# EAGLE design cyberdriver_rev2 (EAGLE 6.5.0)
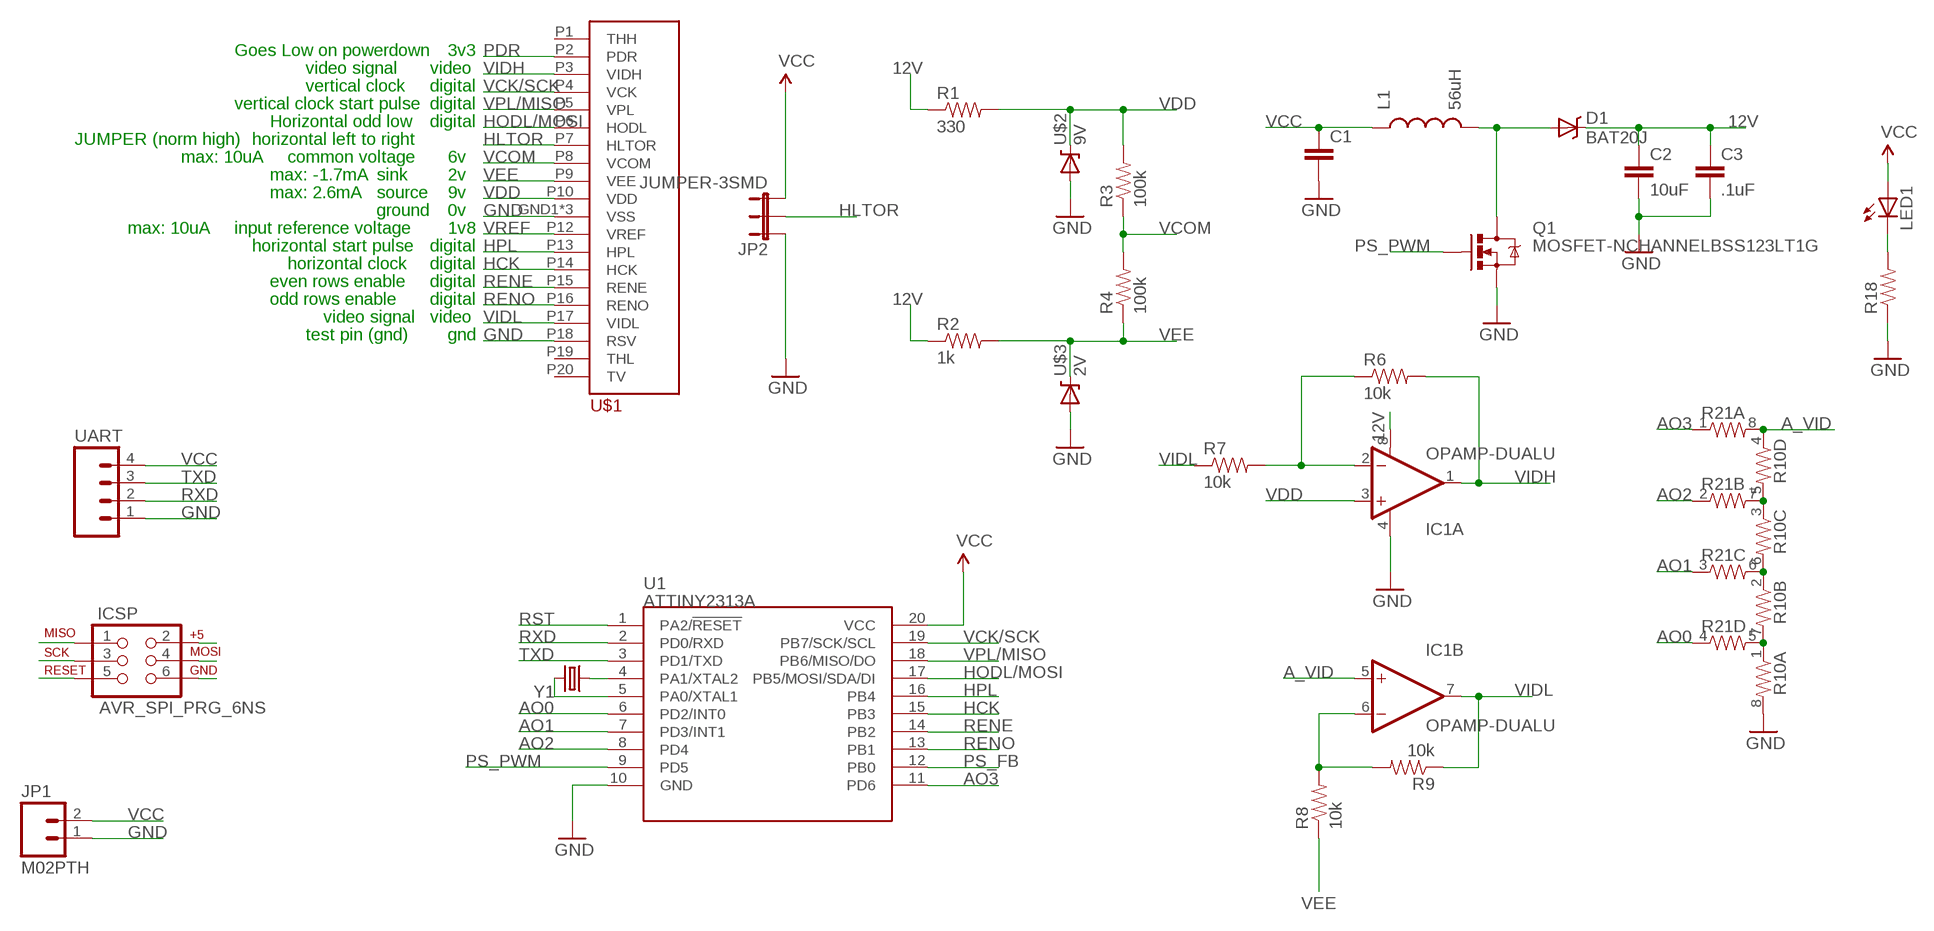
[diagram p0: schematic, sheet 1]

## Parts
C1  CAP1206  [1206]
C2  10uF  CAP1210  [1210]
C3  .1uF  CAP0603-CAP  [0603-CAP]
D1  BAT20J  DIODE-SCHOTTKY-BAT20J  [SOD-323]
IC1  OPAMP-DUALU  [SO08]
ICSP  AVR_SPI_PRG_6NS  [2X3-NS]
JP1  M02PTH  [1X02]
JP2  JUMPER-3SMD  [SJ_3]
L1  56uH  INDUCTORSDR0403-560KL  [SDR0403]
LED1  LED1206  [LED-1206]
Q1  MOSFET-NCHANNELBSS123LT1G  [SOT23]
R1  330  RESISTOR0603-RES  [0603-RES]
R2  1k  RESISTOR0603-RES  [0603-RES]
R3  100k  RESISTOR0603-RES  [0603-RES]
R4  100k  RESISTOR0603-RES  [0603-RES]
R6  10k  RESISTOR0603-RES  [0603-RES]
R7  10k  RESISTOR0603-RES  [0603-RES]
R8  10k  RESISTOR0603-RES  [0603-RES]
R9  10k  RESISTOR0603-RES  [0603-RES]
R10  RESISTOR-ARRAY0603-ARV  [0603-ARV]
R18  RESISTOR0805-RES  [0805]
R21  RESISTOR-ARRAY0603-ARV  [0603-ARV]
U1  ATTINY2313A  [SOP20W]
U$1  CYBERDISPLAY-CONN  [MOLEX-54550-2071]
U$2  9V  DIODE-ZENER-BZT52  [SOD-323]
U$3  2V  DIODE-ZENER-BZT52  [SOD-323]
UART  M041.27MM  [1X04-1.27MM]
Y1  CRYSTAL5X3  [CRYSTAL-SMD-5X3]

## Nets
12V: C2.1 C3.1 D1.C IC1.8(A:V+) R1.1 R2.1
A_VID: IC1.5(B:+IN) R10.4 R21.8
AO0: R21.4 U1.6(PD2/INT0)
AO1: R21.3 U1.7(PD3/INT1)
AO2: R21.2 U1.8(PD4)
AO3: R21.1 U1.11(PD6)
GND: C1.2 C2.2 C3.2 IC1.4(A:V-) ICSP.6 JP1.1 JP2.1 Q1.2(S) R10.8 R18.1 U1.10(GND) U$1.GND1(VSS) U$1.GND20(VSS) U$1.P11(VSS) U$1.P18(RSV) U$2.A U$3.A UART.1
HCK: U1.15(PB3) U$1.P14(HCK)
HLTOR: JP2.2 U$1.P7(HLTOR)
HODL/MOSI: ICSP.4 U1.17(PB5/MOSI/SDA/DI) U$1.P6(HODL)
HPL: U1.16(PB4) U$1.P13(HPL)
N$1: U1.5(PA0/XTAL1) Y1.3
N$2: U1.4(PA1/XTAL2) Y1.1
N$3: LED1.C R18.2
N$4: D1.A L1.P$2 Q1.3(D)
N$5: IC1.2(A:-IN) R6.1 R7.2
N$6: R10.3 R10.5 R21.7
N$7: IC1.6(B:-IN) R8.2 R9.2
N$8: R10.2 R10.6 R21.6
N$9: R10.1 R10.7 R21.5
PDR: U$1.P2(PDR)
PS_FB: U1.12(PB0)
PS_PWM: Q1.1(G) U1.9(PD5)
RENE: U1.14(PB2) U$1.P15(RENE)
RENO: U1.13(PB1) U$1.P16(RENO)
RST: ICSP.5 U1.1(PA2/!RESET)
RXD: U1.2(PD0/RXD) UART.2
TXD: U1.3(PD1/TXD) UART.3
VCC: C1.1 ICSP.2 JP1.2 JP2.3 L1.P$1 LED1.A U1.20(VCC) UART.4
VCK/SCK: ICSP.3 U1.19(PB7/SCK/SCL) U$1.P4(VCK)
VCOM: R3.1 R4.2 U$1.P8(VCOM)
VDD: IC1.3(A:+IN) R1.2 R3.2 U$1.P10(VDD) U$2.C
VEE: R2.2 R4.1 R8.1 U$1.P9(VEE) U$3.C
VIDH: IC1.1(A:OUT) R6.2 U$1.P3(VIDH)
VIDL: IC1.7(B:OUT) R7.1 R9.1 U$1.P17(VIDL)
VPL/MISO: ICSP.1 U1.18(PB6/MISO/DO) U$1.P5(VPL)
VREF: U$1.P12(VREF)
Unconnected: U$1.P1(THH) U$1.P19(THL) U$1.P20(TV)

## Notes on the sheet
- Goes Low on powerdown | 3v3
- video signal | video
- vertical clock | digital
- vertical clock start pulse | digital
- Horizontal odd low | digital
- JUMPER (norm high) | horizontal left to right
- max: 10uA | common voltage | 6v
- max: -1.7mA | sink | 2v
- max: 2.6mA | source | 9v
- ground | 0v
- max: 10uA | input reference voltage | 1v8
- horizontal start pulse | digital
- horizontal clock | digital
- even rows enable | digital
- odd rows enable | digital
- video signal | video
- test pin (gnd) | gnd

## Library data of the parts
C1 = SparkFun-Capacitors:CAP: Capacitor Standard 0603 ceramic capacitor, and 0.1" leaded capacitor.
C2 C3 = cyberdriver:CAP: Capacitor Standard 0603 ceramic capacitor, and 0.1" leaded capacitor.
D1 = cyberdriver:DIODE-SCHOTTKY: Schottky diodes in SFE's production catalog BAT20J 1A 23V 0.62Vf RB751 120mA 40V 0.37Vf PMEG4005EJ 0.5A 40V 0.42Vf MBRA140 1A 40V 0.5Vf B340A 3A 40V SMA; PROD_ID: DIO-11623
IC1 = cyberdriver:OPAMP-DUAL: Generic op-amp footprint
ICSP = cyberdriver:AVR_SPI_PRG_6: AVR ISP 6 Pin This is the reduced ISP connector for AVR programming. Common on Arduino. This footprint will take up less PCB space and can be used with a 10-pin to 6-pin adapter such as SKU: BOB-08508
JP1 = cyberdriver:M02: Standard 2-pin 0.1" header. Use with - straight break away headers ( PRT-00116) - right angle break away headers (PRT-00553) - swiss pins (PRT-00743) - machine pins (PRT-00117) - female headers (PRT-00115) Molex polarized connector foot print use with: PRT-08233 with associated crimp pins and housings. 2.54_SCREWTERM for use with PRT-10571. 3.5mm Screw Terminal footprints for PRT-08084 5mm Screw Terminal footprints for use with PRT-08433
JP2 = SparkFun-Passives:JUMPER-3
L1 = cyberdriver:INDUCTOR: Inductors Basic Inductor/Choke - 0603 and 1206. Footprints are not proven and vary greatly between part numbers. SRN6045- 33uH, 20% 1.4A SDR0403-560KL - 56uH, 10%, 500mA RMS/740mA peak; DIST: DIGIKEY; DIST_ID: SDR0403-560KLCT-ND
LED1 = cyberdriver:LED: LEDs Standard schematic elements and footprints for 5mm, 3mm, 1206, and 0603 sized LEDs. 5mm - Spark Fun Electronics SKU : COM-00529 (and others)
Q1 = cyberdriver:MOSFET-NCHANNEL: Common NMOSFET Parts MFG P/N Store ID Prod ID FDD8780 TRANS-09984 SI7820DN TRANS-11055 FDS6630A IC-08089 2N7002PW TRANS-11151 FQP30N06L COM-10213 TRANS-10060 BSS123LT1G TRANS-08345 BSS138 TRANS-00830 BS170 2N7000; PROD_ID: TRANS-08345
R1-R4 R6-R9 R18 = cyberdriver:RESISTOR: Resistor Basic schematic elements and footprints for 0603, 1206, and PTH resistors.
R10 R21 = SparkFun-Passives:RESISTOR-ARRAY: Array Chip Resistor Source: RS Component / Phycomp
U1 = cyberdriver:ATTINY2313A: ATTINY2313A 2kB 20MHz I2C/SPI/UART; PROD_ID: IC-11305
U$1 = cyberdriver:CYBERDISPLAY-CONN
U$2 U$3 = cyberdriver:DIODE-ZENER: Zener Diode Production Part - 8199 3.4V Zener Voltage
UART = SparkFun-Connectors:M04: Header 4 Standard 4-pin 0.1" header. Use with straight break away headers (SKU : PRT-00116), right angle break away headers (PRT-00553), swiss pins (PRT-00743), machine pins (PRT-00117), and female headers (PRT-00115). Molex polarized connector foot print use with SKU : PRT-08231 with associated crimp pins and housings. 1MM SMD Version SKU: PRT-10208
Y1 = cyberdriver:CRYSTAL: Various standard crystals. Proven footprints. Spark Fun Electronics SKU : COM-00534

## Board
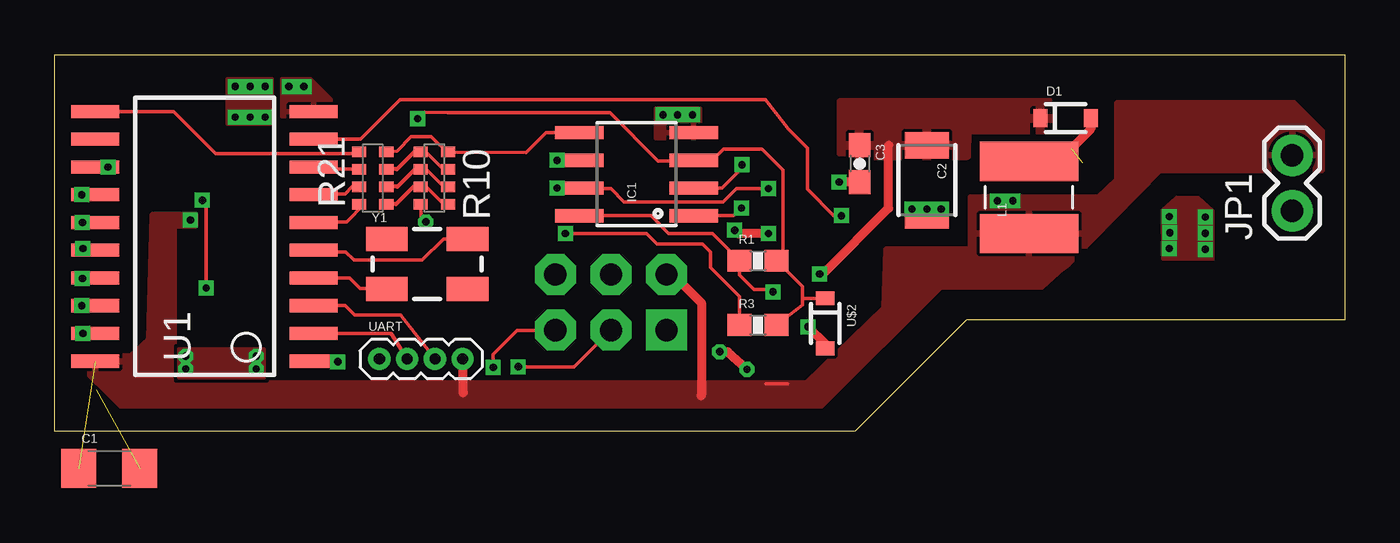
[diagram p1: board, top side]
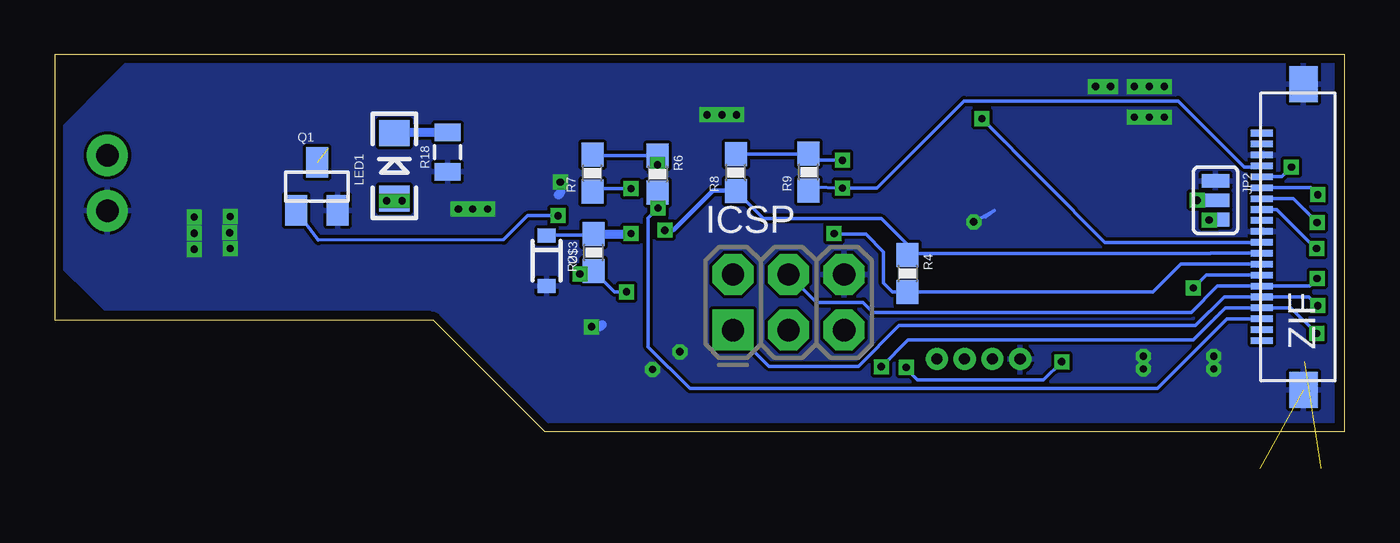
[diagram p2: board, bottom side, seen from below]

Size 59.03 x 17.25 mm. Coordinates in mm from the lower left corner, seen from the top.
Outline: 0,17.25 59.03,17.25 59.03,5.11 41.71,5.11 36.61,0 0,0 0,17.25
Copper layers (1*16): Top 0.035mm / dielectric 1.5mm / Bottom 0.035mm
Design rules "default *": minimum track width 6mil, minimum drill 13mil, track to track 6mil, track to pad 6mil, pad to pad 6mil, via to via 6mil, smd to smd 0mil, copper to edge 15mil, drill to drill 13mil, minimum pad ring 10mil, minimum via ring 7mil, stop-mask expansion 4mil, vias tented up to drill 0mil, thermal gap 6mil

### Footprints (pad centres in the part's own frame; a part is rotated, then mirrored left to right if it is on the bottom)
1206 = smd 1.6 x 1.8: 1 -1.4,0; 2 1.4,0
1210 = smd 1.2 x 2: 1 -1.6,0; 2 1.6,0
0603-CAP = smd 1.1 x 1: 1 -0.85,0; 2 0.85,0
SOD-323 = smd 0.63 x 0.83: A 1.15,0; C -1.15,0
SO08 = smd 0.61 x 2.21: 1 -1.905,-2.616; 2 -0.635,-2.616; 3 0.635,-2.616; 4 1.905,-2.616; 5 1.905,2.616; 6 0.635,2.616; 7 -0.635,2.616; 8 -1.905,2.616
2X3-NS = drill 1.016 pad 1.88 square: 1 -2.54,-1.27 | drill 1.016 pad 1.88 octagon: 2 -2.54,1.27; 3 0,-1.27; 4 0,1.27; 5 2.54,-1.27; 6 2.54,1.27
1X02 = drill 1.016 pad 1.88: 1 0,0; 2 2.54,0
SJ_3 = smd 0.635 x 1.27: 1 -0.889,0; 2 0,0; 3 0.889,0
SDR0403 = smd 1.8 x 4.5: P$1 -1.65,0; P$2 1.65,0
LED-1206 = smd 1.2 x 1.4: A -1.5,0; C 1.5,0
SOT23 = smd 1 x 1.4: 1 -0.95,-1.1; 2 0.95,-1.1; 3 0,1.1
0603-RES = smd 1.1 x 1: 1 -0.85,0; 2 0.85,0
0603-ARV = smd 0.5 x 0.65: 1 -1.2,-0.625; 2 -0.4,-0.625; 3 0.4,-0.625; 4 1.2,-0.625; 5 1.2,0.625; 6 0.4,0.625; 7 -0.4,0.625; 8 -1.2,0.625
0805 = smd 0.8 x 1.2: 1 -0.9,0; 2 0.9,0
SOP20W = smd 0.6 x 2.2: 1 -5.715,-5; 2 -4.445,-5; 3 -3.175,-5; 4 -1.905,-5; 5 -0.635,-5; 6 0.635,-5; 7 1.905,-5; 8 3.175,-5; 9 4.445,-5; 10 5.715,-5; 11 5.715,5; 12 4.445,5; 13 3.175,5; 14 1.905,5; 15 0.635,5; 16 -0.635,5; 17 -1.905,5; 18 -3.175,5; 19 -4.445,5; 20 -5.715,5
MOLEX-54550-2071 = smd 1.65 x 1.3: GND1 -7,-0.95; GND20 7,-0.95 | smd 0.3 x 1: P1 -4.75,0.95; P2 -4.25,0.95; P3 -3.75,0.95; P4 -3.25,0.95; P5 -2.75,0.95; P6 -2.25,0.95; P7 -1.75,0.95; P8 -1.25,0.95; P9 -0.75,0.95; P10 -0.25,0.95; P11 0.25,0.95; P12 0.75,0.95; P13 1.25,0.95; P14 1.75,0.95; P15 2.25,0.95; P16 2.75,0.95; P17 3.25,0.95; P18 3.75,0.95; P19 4.25,0.95; P20 4.75,0.95
1X04-1.27MM = drill 0.508 pad 1: 1 0,0; 2 1.27,0; 3 2.54,0; 4 3.81,0
CRYSTAL-SMD-5X3 = smd 1.9 x 1.1: 1 -1.85,-1.15; 2 1.85,-1.15; 3 1.85,1.15; 4 -1.85,1.15

### Placement (x,y rotation side)
C1  2.5,-1.69 0 top
C2  39.9,11.49 270 top
C3  36.83,12.26 270 top
D1  46.25,14.34 0 top
IC1  26.62,11.77 90 top
ICSP  25.45,5.91 0 bottom
JP1  56.62,10.1 90 top
JP2  5.92,10.58 270 bottom
L1  44.58,10.71 90 top
LED1  43.48,12.15 90 bottom
Q1  47.03,11.21 0 bottom
R1  32.18,7.81 0 top
R2  34.37,8.19 90 bottom
R3  32.18,4.86 0 top
R4  20.02,7.23 270 bottom
R6  31.45,11.77 270 bottom
R7  34.42,11.82 90 bottom
R8  27.86,11.85 90 bottom
R9  24.54,11.87 90 bottom
R10  17.37,11.6 90 top
R18  41.05,12.79 90 bottom
R21  14.55,11.6 270 top
U1  6.86,8.93 90 top
U$1  2.84,8.9 90 bottom
U$2  35.26,4.94 270 top
U$3  36.53,7.81 270 bottom
UART  14.86,3.31 0 top
Y1  17.04,7.66 0 top

### Tracks (layer width: path | path; a pad name or v marks a point on that pad's centre or on a via)
12V  (via drill 0.33)
  Top 0.152: IC1.8 27.28,9.87 28.09,9.05 30.09,9.05 R1.1 31.33,7.16 32,6.49 32.77,6.49 v32.87,6.39
  Top 0.406: v35,7.2 35.14,7.2 38.15,10.21 38.15,13.08
  Bottom 0.152: v32.87,6.39 33.41,6.39 R2.1 34.51,7.2 v35,7.2
  pour Top (rank 2): 35.97,15.05 35.97,12.76 36.12,12.61 41.74,12.62 41.76,13.78 45.5,13.82 45.52,15.05
A_VID
  Top 0.152: R21.8 15.3,12.81 15.66,12.84 16.32,13.5 17.22,13.5 17.93,12.79 R10.4 21.56,12.76 22.48,13.68 IC1.5
AO0
  Top 0.152: R21.4 14.17,10.39 13.36,9.59 11.88,9.59 U1.6
AO1
  Top 0.152: R21.3 13.62,11.19 13.28,10.86 11.88,10.86 U1.7
AO2
  Top 0.152: R21.2 11.97,11.99 U1.8
AO3
  Top 0.152: R21.1 13.82,12.71 7.37,12.71 5.44,14.64 U1.11
GND  (via drill 0.33)  (1 unrouted)
  Top 0.152: R10.8 16.76,9.81 v16.98,9.59
  Top 0.203: v39.9,10.17 C2.2 39.9,9.69
  Top 0.406: U$2.A 35.26,4 v34.47,4.79 | v31.67,2.83 30.79,3.64 v30.43,3.64 | C3.2 v35.9,11.41 v35.89,11.42
  Bottom 0.152: v16.98,9.59 16.03,10.1 16.45,9.82
  Bottom 0.406: v34.47,4.79 34.09,4.79 33.99,4.89 | v35.89,11.42 35.89,10.91 35.98,10.82
  other vias: 8.25,15.79 8.94,15.79 9.63,15.79 8.25,14.39 9.63,14.39 8.94,14.39 10.72,15.79 11.4,15.79 27.84,14.49 28.5,14.49 29.18,14.49 39.22,10.17 40.56,10.17 9.22,3.44 9.22,2.86 5.99,3.44 5.99,2.86 51,9.83 51.02,9.09 51,8.37 52.64,9.8 52.64,9.07 52.64,8.33
  pour Bottom (rank 2): 0.56,16.83 55.75,16.83 59.31,13.27 59.33,8.19 56.74,5.6 41.81,5.6 36.53,0.32 0.56,0.32
  pour Top: 7.9,16.14 9.96,16.14 9.96,14.06 7.9,14.06
  pour Top: 10.39,16.14 10.39,14.41 12.65,14.41 12.65,15.2 11.71,16.14
  pour Top: 27.48,14.8 29.54,14.8 29.54,13.4 27.48,13.4
  pour Top: 5.66,3.77 9.58,3.77 9.58,2.45 5.66,2.45
  pour Top: 52.34,10.69 51.32,10.69 50.69,10.13 50.7,7.89 52.98,7.87 52.98,10.11
HCK  (via drill 0.33)
  Top 0.152: v1.27,9.56 U1.15
  Bottom 0.152: U$1.P14 2.36,10.65 v1.27,9.56
HLTOR  (via drill 0.33)
  Top 0.152: v6.93,6.57 6.93,10.4 v6.76,10.58
  Bottom 0.152: U$1.P7 6.35,7.15 v6.93,6.57 | v6.76,10.58 JP2.2
HODL/MOSI  (via drill 0.33)
  Top 0.152: v1.27,7 1.83,7 U1.17
  Top 0.305: 1.81,6.97 U1.17 1.88,7
  Bottom 0.152: v1.27,7 1.62,6.65 U$1.P6 5.83,6.65 7.04,5.45 21.59,5.45 22.05,5.91 24.18,5.91 ICSP.4
HPL  (via drill 0.33)
  Top 0.152: v1.3,8.37 1.3,8.29 U1.16
  Bottom 0.152: U$1.P13 3.1,10.15 1.32,8.37 v1.3,8.37
N$1
  Top 0.152: Y1.3 17.79,8.81 16.82,7.84 13.69,7.84 13.31,8.22 11.93,8.22 U1.5
N$2
  Top 0.152: U1.4 13.49,7.02 13.97,6.54 15.16,6.54 Y1.1
N$3
  Bottom 0.406: LED1.C 43.45,13.69 R18.2
N$4  (1 unrouted)
  Top 0.406: D1.A 47.4,13.84 46.51,12.94 44.58,12.94 L1.P$2
N$5  (via drill 0.33)
  Top 0.152: IC1.2 30.53,11.14 31.45,12.05 v31.45,12.2
  Bottom 0.152: v31.45,12.2 R6.1 34.37,12.62 R7.2
N$6
  Top 0.152: R10.5 16.96,12.79 17.76,11.99 R10.3
  Top 0.178: R10.5 16.73,12.78 16.45,12.78 15.67,11.99 R21.7
N$7  (via drill 0.33)
  Top 0.152: IC1.6 v22.99,12.41
  Bottom 0.152: R8.2 24.56,12.7 R9.2 24.22,12.41 v22.99,12.41
N$8
  Top 0.152: R10.2 17.8,11.19 17,11.99 R10.6
  Top 0.178: R10.6 16.7,11.95 16.45,11.95 15.69,11.19 R21.6
N$9
  Top 0.152: R10.1 17.79,10.39 16.99,11.19 R10.7
  Top 0.178: R10.7 16.41,11.19 15.62,10.39 R21.5
PS_PWM  (via drill 0.33)
  Top 0.152: U1.9 14,13.37 15.8,15.18 32.51,15.18 33.58,13.83 34.44,12.97 34.44,11.09 35.69,9.84 35.97,9.84 v35.99,9.87
  Bottom 0.152: v35.99,9.87 37.39,9.87 38.48,8.78 46.96,8.75 Q1.1
RENE  (via drill 0.33)
  Top 0.152: v1.24,10.83 U1.14
  Bottom 0.152: U$1.P15 1.56,11.15 v1.24,10.83
RENO  (via drill 0.33)
  Top 0.152: v2.44,12.1 U1.13
  Bottom 0.152: U$1.P16 2.89,11.65 v2.44,12.1
RST  (via drill 0.33)
  Top 0.152: U1.1 12.93,3.21 v12.95,3.19 | v20.07,2.93 20.07,3.52 21.16,4.61 22.89,4.61 ICSP.5
  Bottom 0.152: v12.95,3.19 13.79,2.35 19.56,2.35 20.07,2.86 v20.07,2.93
RXD
  Top 0.152: UART.2 15.39,4.48 U1.2
TXD
  Top 0.152: U1.3 13.28,5.75 13.72,5.32 15.82,5.32 UART.3
VCC  (via drill 0.33)  (1 unrouted)
  Top 0.152: 32.54,2.17 33.53,2.17
  Top 0.406: ICSP.2 28.3,7.18 29.59,5.88 29.59,1.64 | UART.4 18.67,1.79 18.69,1.77
  Bottom 0.152: JP2.3 v6.21,9.68
  Bottom 0.203: v43.84,10.55 43.74,10.65 LED1.A
  other vias: 43.13,10.55
  pour Top (rank 2): 47.75,10.71 48.62,11.52 48.62,15.02 56.69,15.02 57.96,13.75 57.96,11.95 50.57,11.95 46.38,7.68 46.1,7.48 45.16,6.64 40.54,6.64 35.08,1.18 3.02,1.18 1.02,3.19 2.39,3.19 3.1,3.44 3.48,3.44 4.32,4.2 4.48,9.91 6.43,9.89 6.43,9.41 5.44,9.4 5.44,3.04 6.27,2.2 34.39,2.2 37.97,5.65 38.05,8.32 41.91,8.32 41.91,10.73
VCK/SCK  (via drill 0.33)
  Top 0.152: v1.3,4.48 U1.19 | v21.21,2.96 23.77,2.96 ICSP.3
  Bottom 0.152: v1.3,4.48 2.47,5.65 U$1.P4 5.46,5.65 6.93,4.18 19.99,4.18 v21.21,2.96
VCOM  (via drill 0.33)
  Top 0.152: v23.37,9.05 27.08,9.05 27.56,8.57 29.64,8.57 30,8.22 30,7.51 31.33,6.17 R3.1
  Bottom 0.152: U$1.P8 7.5,7.65 8.78,6.38 R4.2 20.69,6.38 21.11,6.79 21.11,8.22 21.92,9.03 23.34,9.03 v23.37,9.05
VDD  (via drill 0.33)
  Top 0.152: v16.61,14.31 16.93,14.6 17.98,14.59 25.4,14.59 27.61,12.38 29.21,12.38 IC1.3 30.1,12.41 30.61,12.92 32.36,12.92 33.33,11.95 33.33,8.1 R1.2 34.21,6.63 34.21,6.01 | R3.2 34.21,5.79 34.21,6.01 | U$2.C 34.3,6.09 34.21,6.01
  Bottom 0.152: U$1.P10 10.98,8.65 v16.61,14.31
VEE  (via drill 0.33)
  Top 0.406: v32.66,9.05 31.27,9.05 v31.12,9.21
  Bottom 0.152: U$1.P9 6.14,8.15 6.15,8.14 19.95,8.14 R4.1 20.09,8.15 20.09,8.62 21.21,9.74 26.61,9.74 R8.1 | R2.2 34.43,8.98 36.51,8.98 U$3.C
  Bottom 0.203: v31.12,9.21 30.72,9.21 28.91,11.02 27.89,11.02 R8.1
  Bottom 0.406: R2.2 32.68,9.04 v32.66,9.05
VIDH  (via drill 0.33)
  Top 0.152: IC1.1 31.06,9.87 v31.42,10.22
  Bottom 0.152: U$1.P3 5.4,5.15 8.59,1.97 29.97,1.97 31.88,3.87 31.88,9.77 v31.42,10.22 31.42,10.9 R6.2
VIDL  (via drill 0.33)
  Top 0.152: v22.99,11.14 IC1.7 24.03,11.11 25.45,11.11 26.06,10.5 30.58,10.5 31.19,11.11 v32.66,11.11
  Bottom 0.152: U$1.P17 3.84,12.1 4.6,12.1 7.62,15.13 17.42,15.13 21.41,11.14 v22.99,11.14 24.37,11.19 R9.1 | R7.1 34.28,11.11 v32.66,11.11
VPL/MISO  (via drill 0.33)
  Top 0.152: v1.24,5.75 U1.18
  Bottom 0.152: v1.24,5.75 1.64,6.15 U$1.P5 5.52,6.15 6.83,4.84 20.4,4.84 22.25,2.98 26.34,2.98 ICSP.1